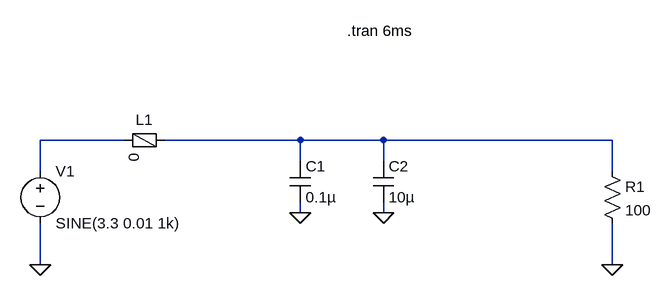
[diagram p0: schematic MicroSDConnector.asc]
MicroSDConnector.asc, the LTspice schematic file:
Version 4
SHEET 1 916 680
WIRE 96 256 -32 256
WIRE 368 256 160 256
WIRE 496 256 368 256
WIRE 848 256 496 256
WIRE 368 288 368 256
WIRE 496 288 496 256
WIRE -32 304 -32 256
WIRE 848 304 848 256
WIRE 368 368 368 352
WIRE 496 368 496 352
WIRE -32 448 -32 384
WIRE 848 448 848 384
FLAG -32 448 0
FLAG 848 448 0
FLAG 368 368 0
FLAG 496 368 0
SYMBOL voltage -32 288 R0
SYMATTR InstName V1
SYMATTR Value SINE(3.3 0.01 1k)
SYMBOL cap 352 288 R0
SYMATTR InstName C1
SYMATTR Value 0.1µ
SYMBOL cap 480 288 R0
SYMATTR InstName C2
SYMATTR Value 10µ
SYMBOL res 832 288 R0
SYMATTR InstName R1
SYMATTR Value 100
SYMBOL FerriteBead 128 256 R90
WINDOW 0 -16 0 VBottom 2
SYMATTR InstName L1
SYMATTR Value 0
SYMATTR SpiceLine Rser=100 Rpar=0 Cpar=0
TEXT 440 88 Left 2 !.tran 6ms

The netlist it stands for:
* MicroSDConnector.asc
V1 N001 0 SINE(3.3 0.01 1k)
C1 N002 0 0.1µ
C2 N002 0 10µ
R1 N002 0 100
L1 N002 N001 0 Rser=100 Rpar=0 Cpar=0
.tran 6ms
.backanno
.end